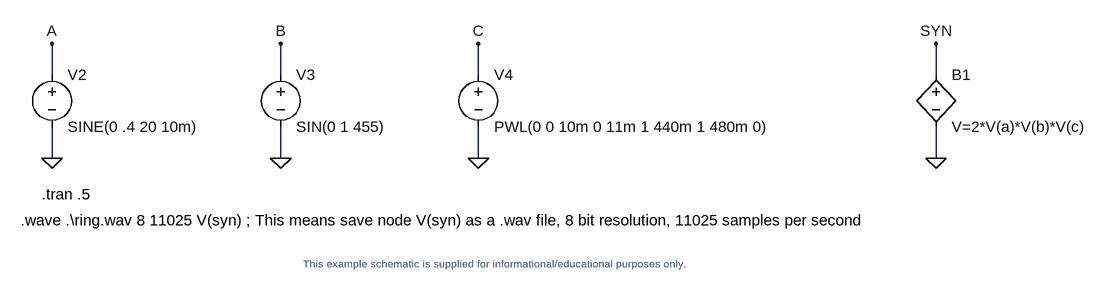
[diagram p0: schematic waveout.asc]
waveout.asc, the LTspice schematic file:
Version 4
SHEET 1 2680 864
WIRE 1008 560 1008 512
WIRE 1360 560 1360 512
WIRE 1664 560 1664 512
WIRE 2368 560 2368 512
WIRE 1008 688 1008 640
WIRE 1360 688 1360 640
WIRE 1664 688 1664 640
WIRE 2368 688 2368 640
FLAG 1008 688 0
FLAG 1360 688 0
FLAG 1008 512 A
FLAG 1360 512 B
FLAG 2368 688 0
FLAG 1664 688 0
FLAG 1664 512 C
FLAG 2368 512 SYN
SYMBOL VOLTAGE 1008 544 R0
WINDOW 39 0 0 Left 2
WINDOW 123 0 0 Left 2
SYMATTR InstName V2
SYMATTR Value SINE(0 .4 20 10m)
SYMBOL voltage 1360 544 R0
SYMATTR InstName V3
SYMATTR Value SIN(0 1 455)
SYMBOL BV 2368 544 R0
SYMATTR InstName B1
SYMATTR Value V=2*V(a)*V(b)*V(c)
SYMBOL voltage 1664 544 R0
WINDOW 39 24 117 Left 2
WINDOW 123 24 138 Left 2
SYMATTR InstName V4
SYMATTR Value PWL(0 0 10m 0 11m 1 440m 1 480m 0)
TEXT 992 744 Left 2 !.tran .5
TEXT 960 784 Left 2 !.wave .\\ring.wav 8 11025 V(syn) ; This means save node V(syn) as a .wav file, 8 bit resolution, 11025 samples per second
TEXT 1680 840 Top 1 ;This example schematic is supplied for informational/educational purposes only.

The netlist it stands for:
* waveout.asc
V2 A 0 SINE(0 .4 20 10m)
V3 B 0 SIN(0 1 455)
B1 SYN 0 V=2*V(a)*V(b)*V(c)
V4 C 0 PWL(0 0 10m 0 11m 1 440m 1 480m 0)
.tran .5
.wave .\ring.wav 8 11025 V(syn) ; This means save node V(syn) as a .wav file, 8 bit resolution, 11025 samples per second
* This example schematic is supplied for informational/educational purposes only.
.backanno
.end